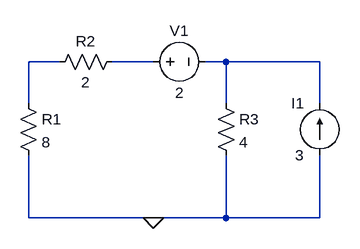
[diagram p0: schematic Draft16.asc]
Draft16.asc, the LTspice schematic file:
Version 4
SHEET 1 880 680
WIRE 96 48 48 48
WIRE 240 48 176 48
WIRE 352 48 320 48
WIRE 496 48 352 48
WIRE 48 112 48 48
WIRE 352 112 352 48
WIRE 496 112 496 48
WIRE 48 288 48 192
WIRE 240 288 48 288
WIRE 352 288 352 192
WIRE 352 288 240 288
WIRE 496 288 496 192
WIRE 496 288 352 288
FLAG 240 288 0
SYMBOL res 32 96 R0
SYMATTR InstName R1
SYMATTR Value 8
SYMBOL res 192 32 R90
WINDOW 0 0 56 VBottom 2
WINDOW 3 32 56 VTop 2
SYMATTR InstName R2
SYMATTR Value 2
SYMBOL voltage 224 48 R270
WINDOW 0 32 56 VTop 2
WINDOW 3 -32 56 VBottom 2
SYMATTR InstName V1
SYMATTR Value 2
SYMBOL res 336 96 R0
SYMATTR InstName R3
SYMATTR Value 4
SYMBOL current 496 192 R180
WINDOW 0 24 80 Left 2
WINDOW 3 24 0 Left 2
SYMATTR InstName I1
SYMATTR Value 3

The netlist it stands for:
* Draft16.asc
R1 N001 0 8
R2 N002 N001 2
V1 N002 N003 2
R3 N003 0 4
I1 0 N003 3
.backanno
.end